# Altium schematic sheet IO Logic Block.SchDoc
size 431 x 279 mm; Organization: ORGANIZATION; Address1: ADDRESS 1; Address2: ADDRESS 2; Address3: ADDRESS 3; Address4: ADDRESS 4; Revision: -; SheetNumber: 2; SheetTotal: 8; ENG_APP_DATE: --/--/--; DSN_APP_DATE: --/--/--; CHK_APP_DATE: --/--/--
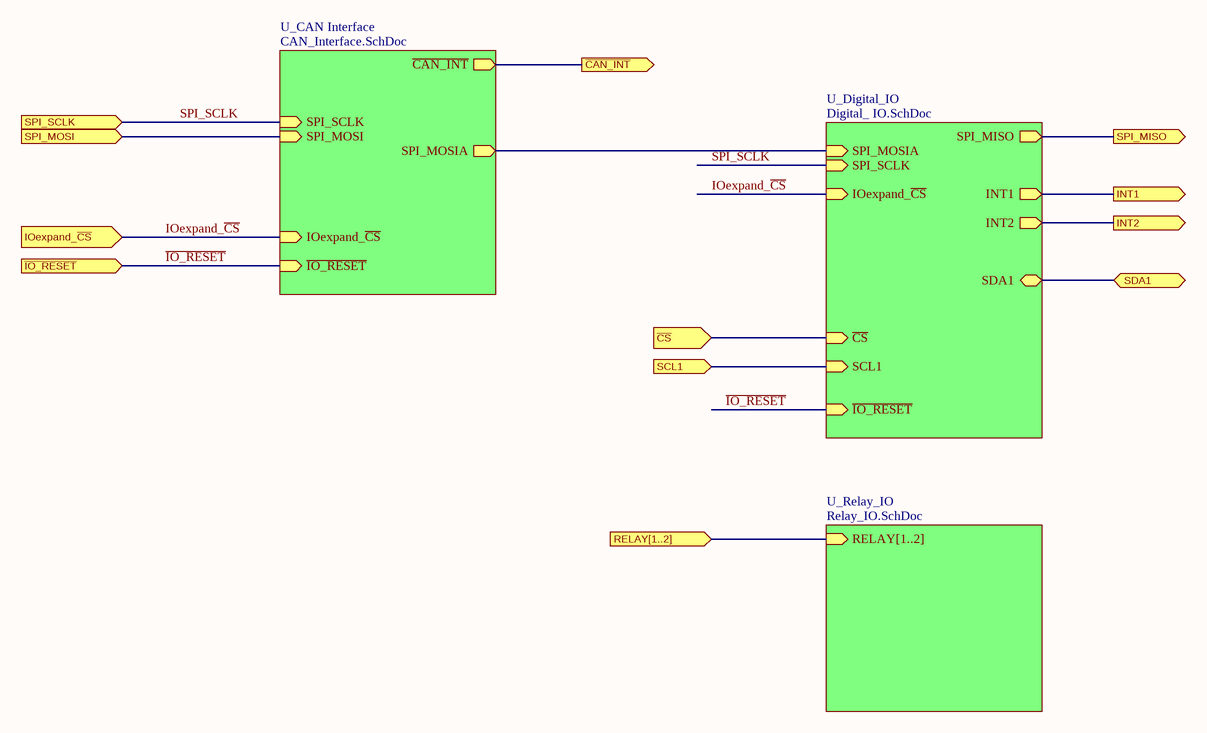
[diagram p0: IO Logic Block.SchDoc]

## Sub-sheets
U_CAN Interface = CAN_Interface.SchDoc: ~{CAN_INT} (out), SPI_SCLK (in), SPI_MOSI (in), SPI_MOSIA (out), ~{IO_RESET} (in), IOexpand_~{CS} (in)
U_Digital_IO = Digital_ IO.SchDoc: IOexpand_~{CS} (in), SPI_SCLK (in), SPI_MOSIA (in), SPI_MISO (out), ~{IO_RESET} (in), INT1 (out), INT2 (out), ~{CS} (in), SDA1 (bidir), SCL1 (in)
U_Relay_IO = Relay_IO.SchDoc: RELAY[1..2] (in)

## Ports
INT1 (out), INT2 (out), IOexpand_~{CS} (in), RELAY[1..2] (in), SCL1 (in), SDA1 (bidir), SPI_MISO (out), SPI_MOSI (in), SPI_SCLK (in), ~{CAN_INT} (out), ~{CS} (in), ~{IO_RESET} (in)

## Nets
~{CAN_INT}: port ~{CAN_INT}, sheet U_CAN Interface/~{CAN_INT}
~{IO_RESET}: port ~{IO_RESET}, sheet U_Digital_IO/~{IO_RESET}, sheet U_CAN Interface/~{IO_RESET}
~{CS}: port ~{CS}, sheet U_Digital_IO/~{CS}
INT1: port INT1, sheet U_Digital_IO/INT1
INT2: port INT2, sheet U_Digital_IO/INT2
IOexpand_~{CS}: port IOexpand_~{CS}, sheet U_Digital_IO/IOexpand_~{CS}, sheet U_CAN Interface/IOexpand_~{CS}
SCL1: port SCL1, sheet U_Digital_IO/SCL1
SDA1: port SDA1, sheet U_Digital_IO/SDA1
SPI_MISO: port SPI_MISO, sheet U_Digital_IO/SPI_MISO
SPI_MOSI: port SPI_MOSI, sheet U_CAN Interface/SPI_MOSI
SPI_SCLK: port SPI_SCLK, sheet U_Digital_IO/SPI_SCLK, sheet U_CAN Interface/SPI_SCLK
(unnamed): sheet U_Digital_IO/SPI_MOSIA, sheet U_CAN Interface/SPI_MOSIA

## Buses and harness runs
bus port RELAY[1..2] = sheet U_Relay_IO/RELAY[1..2]

## Notes on the sheet
- DWG. NO.
- REV.
- SHT.
- THIS DOCUMENT AND THE DATA DISCLOSED HEREIN OR HEREWITH IS THE PROPERTY OF ALTIUM LIMITED AND MAY BE FREELY DISTRIBUTED IN WHOLE. NO RIGHTS ARE RESERVED OR EXPRESS OR IMPLIED WARANTEE GIVEN.
- REVISION
- DESCRIPTION
- DATE
- APPROVED
- ENG:
- DSN:
- APPROVALS
- PROJECT REVISION:
- www.altium.com <http://www.altium.com>
- DOCUMENT REVISION:
- 92037, La Jolla
- USA
- Altium Ltd.
- 4225 Executive Square
- CHK:
- REFERENCE DOCUMENTS
- DESIGN ITEM:
- TITLE
- VARIANT
- BOM:
- FAB DWG:
- PCB DWG:
- ASSY DWG:
- SCALE:
- SIZE
- B
- CAGE CODE
- FILE NAME
- DWG NO.
- SHEET
- OF
- REV